# Altium schematic sheet ControllerPower.SchDoc
size A4
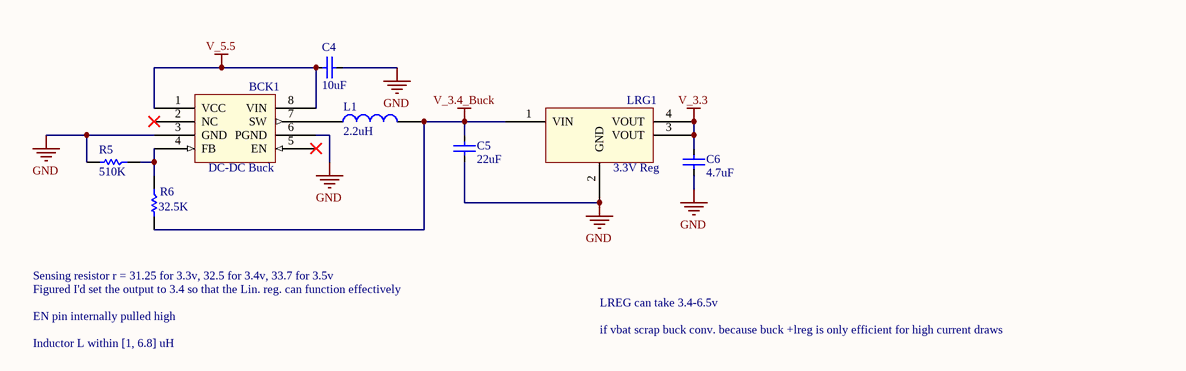
[diagram p0: ControllerPower.SchDoc]

## Parts
BCK1  DC-DC Buck  [SOP8_AP3435]
C4  10uF  [CAP0603R]
C5  22uF  [CAP0805R]
C6  4.7uF  [CAP0603R]
L1  2.2uH  [744031004]
LRG1  3.3V Reg  [SOT223_AP2114]
R5  510K  [RES0603R]
R6  32.5K  [RES0603R]

## Nets
GND: BCK1.3(GND) BCK1.6(PGND) C4.1 C5.2 C6.2 LRG1.2(GND) R5.2
V_3.3: C6.1 LRG1.3(VOUT) LRG1.4(VOUT)
V_3.4_Buck: C5.1 L1.2 LRG1.1(VIN) R6.2
V_5.5: BCK1.1(VCC) BCK1.8(VIN) C4.2
NetBCK1_4: BCK1.4(FB) R5.1 R6.1
NetBCK1_7: BCK1.7(SW) L1.1

Not connected (* = marked no-connect by the designer): BCK1 2(NC)* 5(EN)*

## Notes on the sheet
- Sensing resistor r = 31.25 for 3.3v, 32.5 for 3.4v, 33.7 for 3.5v
- Inductor L within [1, 6.8] uH
- Figured I'd set the output to 3.4 so that the Lin. reg. can function effectively
- EN pin internally pulled high
- if vbat scrap buck conv. because buck +lreg is only efficient for high current draws
- LREG can take 3.4-6.5v

## Library data of the parts
BCK1 = DC-DC Buck: AP3435, 1.0MHz, 3.5A, Synchronous Step Down DC-DC Converter; Manufacturer: Diodes Inc; Manufacturer Part Num: AP3435MPTR-G1; Supplier 1: Digikey; Supplier Part Number 1: AP3435MPTR-G1DICT-ND
C4-C6 = C: Capacitor; Manufacturer: Microchip Technology; Manufacturer Part Num: MIC5378YC5-TR; Class I: Passive; Revision: July-2002: Re-released for DXP Platform.; Supplier 1: Digikey; Supplier Part Number 1: *; Supplier Part Number 1: 1611-MIC5378YC5-CT-ND
  C4: Value: 10uF
  C5: Value: 22uF
  C6: Value: 4.7uF
L1 = L: Inductor; Value: 1uH; Supplier 1: Digikey; Supplier Part Number 1: *
LRG1 = Reg 3.3V: AP2114H-3.3TRG1; Manufacturer: Diodes Inc; Value: Value; Manufacturer Part Num: AP2114H-3.3TRG1; Supplier 1: Digikey
R5 R6 = R: Resistor; Supplier 1: Digikey; Supplier Part Number 1: *
  R5: Value: 510K
  R6: Value: 32.5K